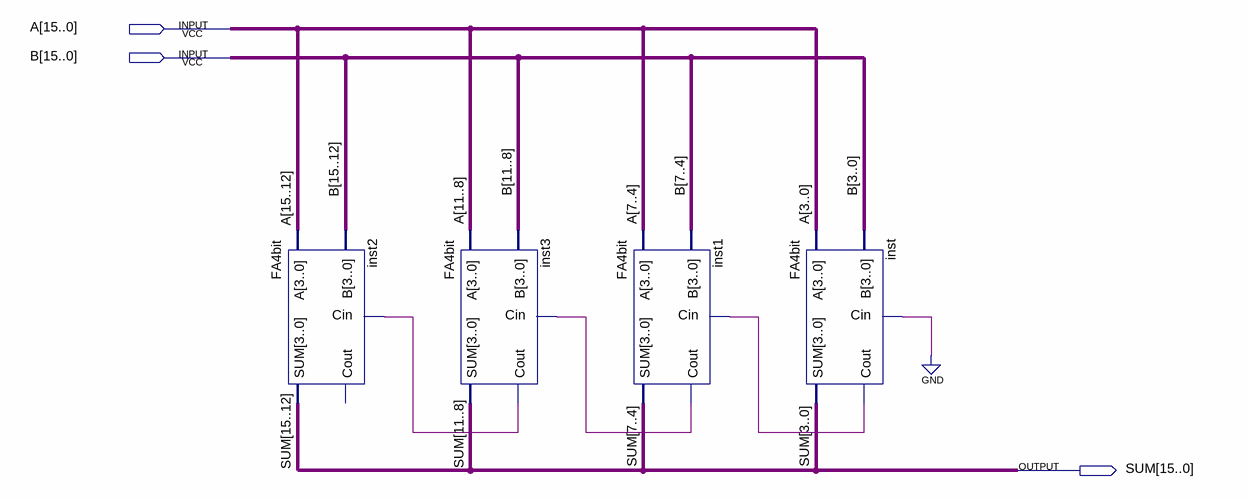
[diagram p0: schematic sheet]
// Quartus schematic FA16bit.bdf as structural Verilog: 4 symbols, 3 pins
module FA16bit (
  input  [15:0] A,
  input  [15:0] B,
  output [15:0] SUM
);

  wire inst1_cout, inst3_cout, inst_cout;

  FA4bit inst2 (.A(A[15:12]), .B(B[15:12]), .Cin(inst3_cout), .SUM(SUM[15:12]));  // open: Cout
  FA4bit inst3 (.A(A[11:8]), .B(B[11:8]), .Cin(inst1_cout), .SUM(SUM[11:8]), .Cout(inst3_cout));
  FA4bit inst1 (.A(A[7:4]), .B(B[7:4]), .Cin(inst_cout), .SUM(SUM[7:4]), .Cout(inst1_cout));
  FA4bit inst (.A(A[3:0]), .B(B[3:0]), .Cin(1'b0), .SUM(SUM[3:0]), .Cout(inst_cout));
endmodule
